# Altium schematic sheet Other.SchDoc
size A; SheetNumber: 4; SheetTotal: 4
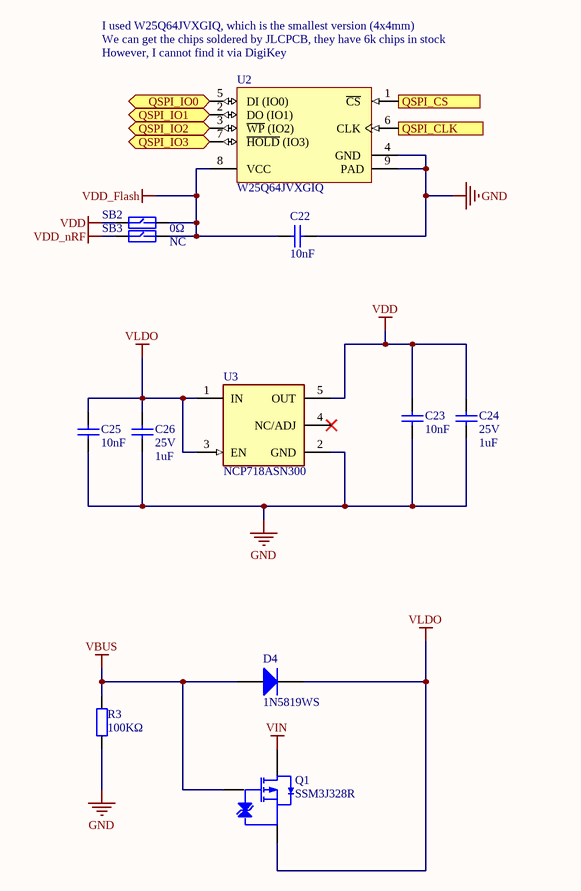
[diagram p0: Other.SchDoc]

## Parts
C22  value 10nF  [0402_C]  (hidden comment: 10nF (103) 10% 50V)
C23  value 10nF  [0402_C]  (hidden comment: 10nF (103) 10% 50V)
C24  value 1uF  Voltage: 25V  [0402_C]  (hidden comment: 1uF (105) 10% 25V)
C25  value 10nF  [0402_C]  (hidden comment: 10nF (103) 10% 50V)
C26  value 1uF  Voltage: 25V  [0402_C]  (hidden comment: 1uF (105) 10% 25V)
D4  1N5819WS  [SOD-323]
Q1  SSM3J328R  [SOT-23-3L]
R3  value 100KΩ  [0402_R]  (hidden comment: 100KΩ (1003) ±1%)
SB2  0Ω  [0603-FUSE]
SB3  NC  [0603-FUSE]
U2  W25Q64JVXGIQ  [W25Qxx-xSON127P600-8N]
U3  NCP718ASN300  [SOT-23-5L]

## Ports
QSPI_CLK (in, see Collection[2C]), QSPI_CS (in, see Collection[2C]), QSPI_IO0 (bidir, see Collection[2C]), QSPI_IO1 (bidir, see Collection[2C]), QSPI_IO2 (bidir, see Collection[2C]), QSPI_IO3 (bidir, see Collection[2C])

## Nets
GND: C22.2 C23.1 C24.1 C25.1 C26.1 R3.1 U2.4(GND) U2.9(PAD) U3.2(GND)
VBUS: D4.1(A) Q1.1(G) R3.2
VDD: C23.2 C24.2 SB2.1 U3.5(OUT)
VDD_Flash: C22.1 SB2.2 SB3.2 U2.8(VCC)
VDD_nRF: SB3.1
VIN: Q1.3(D)
VLDO: C25.2 C26.2 D4.2(K) Q1.2(S) U3.1(IN) U3.3(EN)
QSPI_CLK: U2.6(CLK) ; port QSPI_CLK
QSPI_CS: U2.1(~{CS}) ; port QSPI_CS
QSPI_IO0: U2.5(DI_(IO0)) ; port QSPI_IO0
QSPI_IO1: U2.2(DO_(IO1)) ; port QSPI_IO1
QSPI_IO2: U2.3(~{WP}_(IO2)) ; port QSPI_IO2
QSPI_IO3: U2.7(~{HOLD}_(IO3)) ; port QSPI_IO3

Not connected (* = marked no-connect by the designer): U3 4(NC/ADJ)*

## Notes on the sheet
- I used W25Q64JVXGIQ, which is the smallest version (4x4mm)
- We can get the chips soldered by JLCPCB, they have 6k chips in stock
- (near U2) However, I cannot find it via DigiKey

## Library data of the parts
C22 C23 C25 = 0402 10nF (103) 10% 50V: Chip Capacitor; Package: 0402; Voltage: 50V
C24 C26 = 0402 1uF (105) 10% 25V: Chip Capacitor
D4 = 1N5819WS: Maximum Average Forward Rectified Current: 1A; Maximum Forward Voltage: 1V; JLCPCB Part Number: C191023; ComponentLink1Description: Datasheet; ComponentLink1URL: https://datasheet.lcsc.com/lcsc/2204281430_Guangdong-Hottech-1N5819WS_C191023.pdf
Q1 = SSM3J328R: 20V 6A 29.8mΩ@4.5V,3A 1W P Channel SOT-23(TO-236)  MOSFETs ROHS; ComponentLink1Description: 供应商链接; ComponentLink1URL: http://www.szlcsc.com/product/details_15801.html; Package: SOT-23F; Supplier: LC; SuppliersPartNumber: C15127
R3 = 0402 100KΩ (1003) 1%: Chip Resistor; Package: 0402
SB2 SB3 = Test-Fuse: Fuse easy soldering for test
U2 = W25Q64JVXGIQ: 3V 64M-Bit Serial Flash Memory with Dual/Quad SPI & QPI, 2.7 to 3.6 V, -40 to 85 degC, 8-Pin XSON, RoHS, Tape and Reel; Manufacturer: Winbond; Manufacturer Part Number: W25Q64FVSSIG; Boot Type: Bottom/Top; Word Size: 8b; Cell Type: NOR; Operating Supply Voltage (Min): 2.7V; Operating Supply Voltage (Max): 3.6V; Rad Hardened: No; Density: 67108864Bit; Address Bus: 1b; Supply Current: 40mA; Sync/Async: Synchronous; Number of Words: 8M; Programmable: Yes; Operating Supply Voltage (Typ): 3/3.3V; Access Time (Max): 8.5ns; Interface Type: Serial(SPI); Operating Temperature Classification: Industrial; Datasheet Version: Rev. D, 12/2011; Operating Temp Range: -40Cto85C; Operating Temperature (Max): 85C; Pin Count: 8; Mounting: SurfaceMount; Program/Erase Volt (Typ): 2.7to3.6V; Operating Temperature (Min): -40C; Package Description: 8-Pin Small Outline Integrated Circuit, Body 5.28 x 5.28 mm, Pitch 1.27 mm; Datasheet URL: https://datasheet.ciiva.com/15126/getdatasheetpartid-552937-15126648.pdf; Package Reference: SS-8; Manufacturer URL: http://www.winbond.com/hq/index.html?__locale=en; Package Type: SOIC
U3 = NCP718ASN300: 3V LDO 300 MA LOW IQ WIDE INPUT; Manufacturer Part Number: NCP718BSNADJT1G; Manufacturer: On Semiconductor; Max Supply Voltage: 24V; Output Type: AdjustableProgrammable; Min Supply Voltage: 2.5V; Max Junction Temp: +125°C; Nominal Supply Current: 50-300uA; Dropout Voltage: 480mV; Accuracy Percentage: 2%; Standoff Height: 0.01mm; Output Voltage: 1.2-5V; Number Of Outputs: 1; Output Current: 300mA; Lead Free: Yes; Temperature: to +125°C; ComponentLink2URL: https://www.onsemi.com/pub/Collateral/NCP718-D.PDF; Height: 1mm; ComponentLink2Description: Datasheet; Octopart: https://octopart.com/ncp718bsnadjt1g-on+semiconductor-87658781; Device Class L1: Integrated Circuits (ICs); Device Class L2: Power Management ICs; Device Class L3: Voltage Regulators - Linear; Digikey Description: 300 MA LOW IQ WIDE INPUT; Temperature Range High: +125°C; Package: 419AE-01; Mouser Description: LDO Regulator, 300 mA, Wide Vin, Ultra-Low Iq Adjustable, Non-Active Discharge, TSOT23-5; Category: IC; Automotive: No; RoHS: TRUE; Manufacturer: ON Semiconductor